# EAGLE design RSS 1.0 (EAGLE 6.5.0)
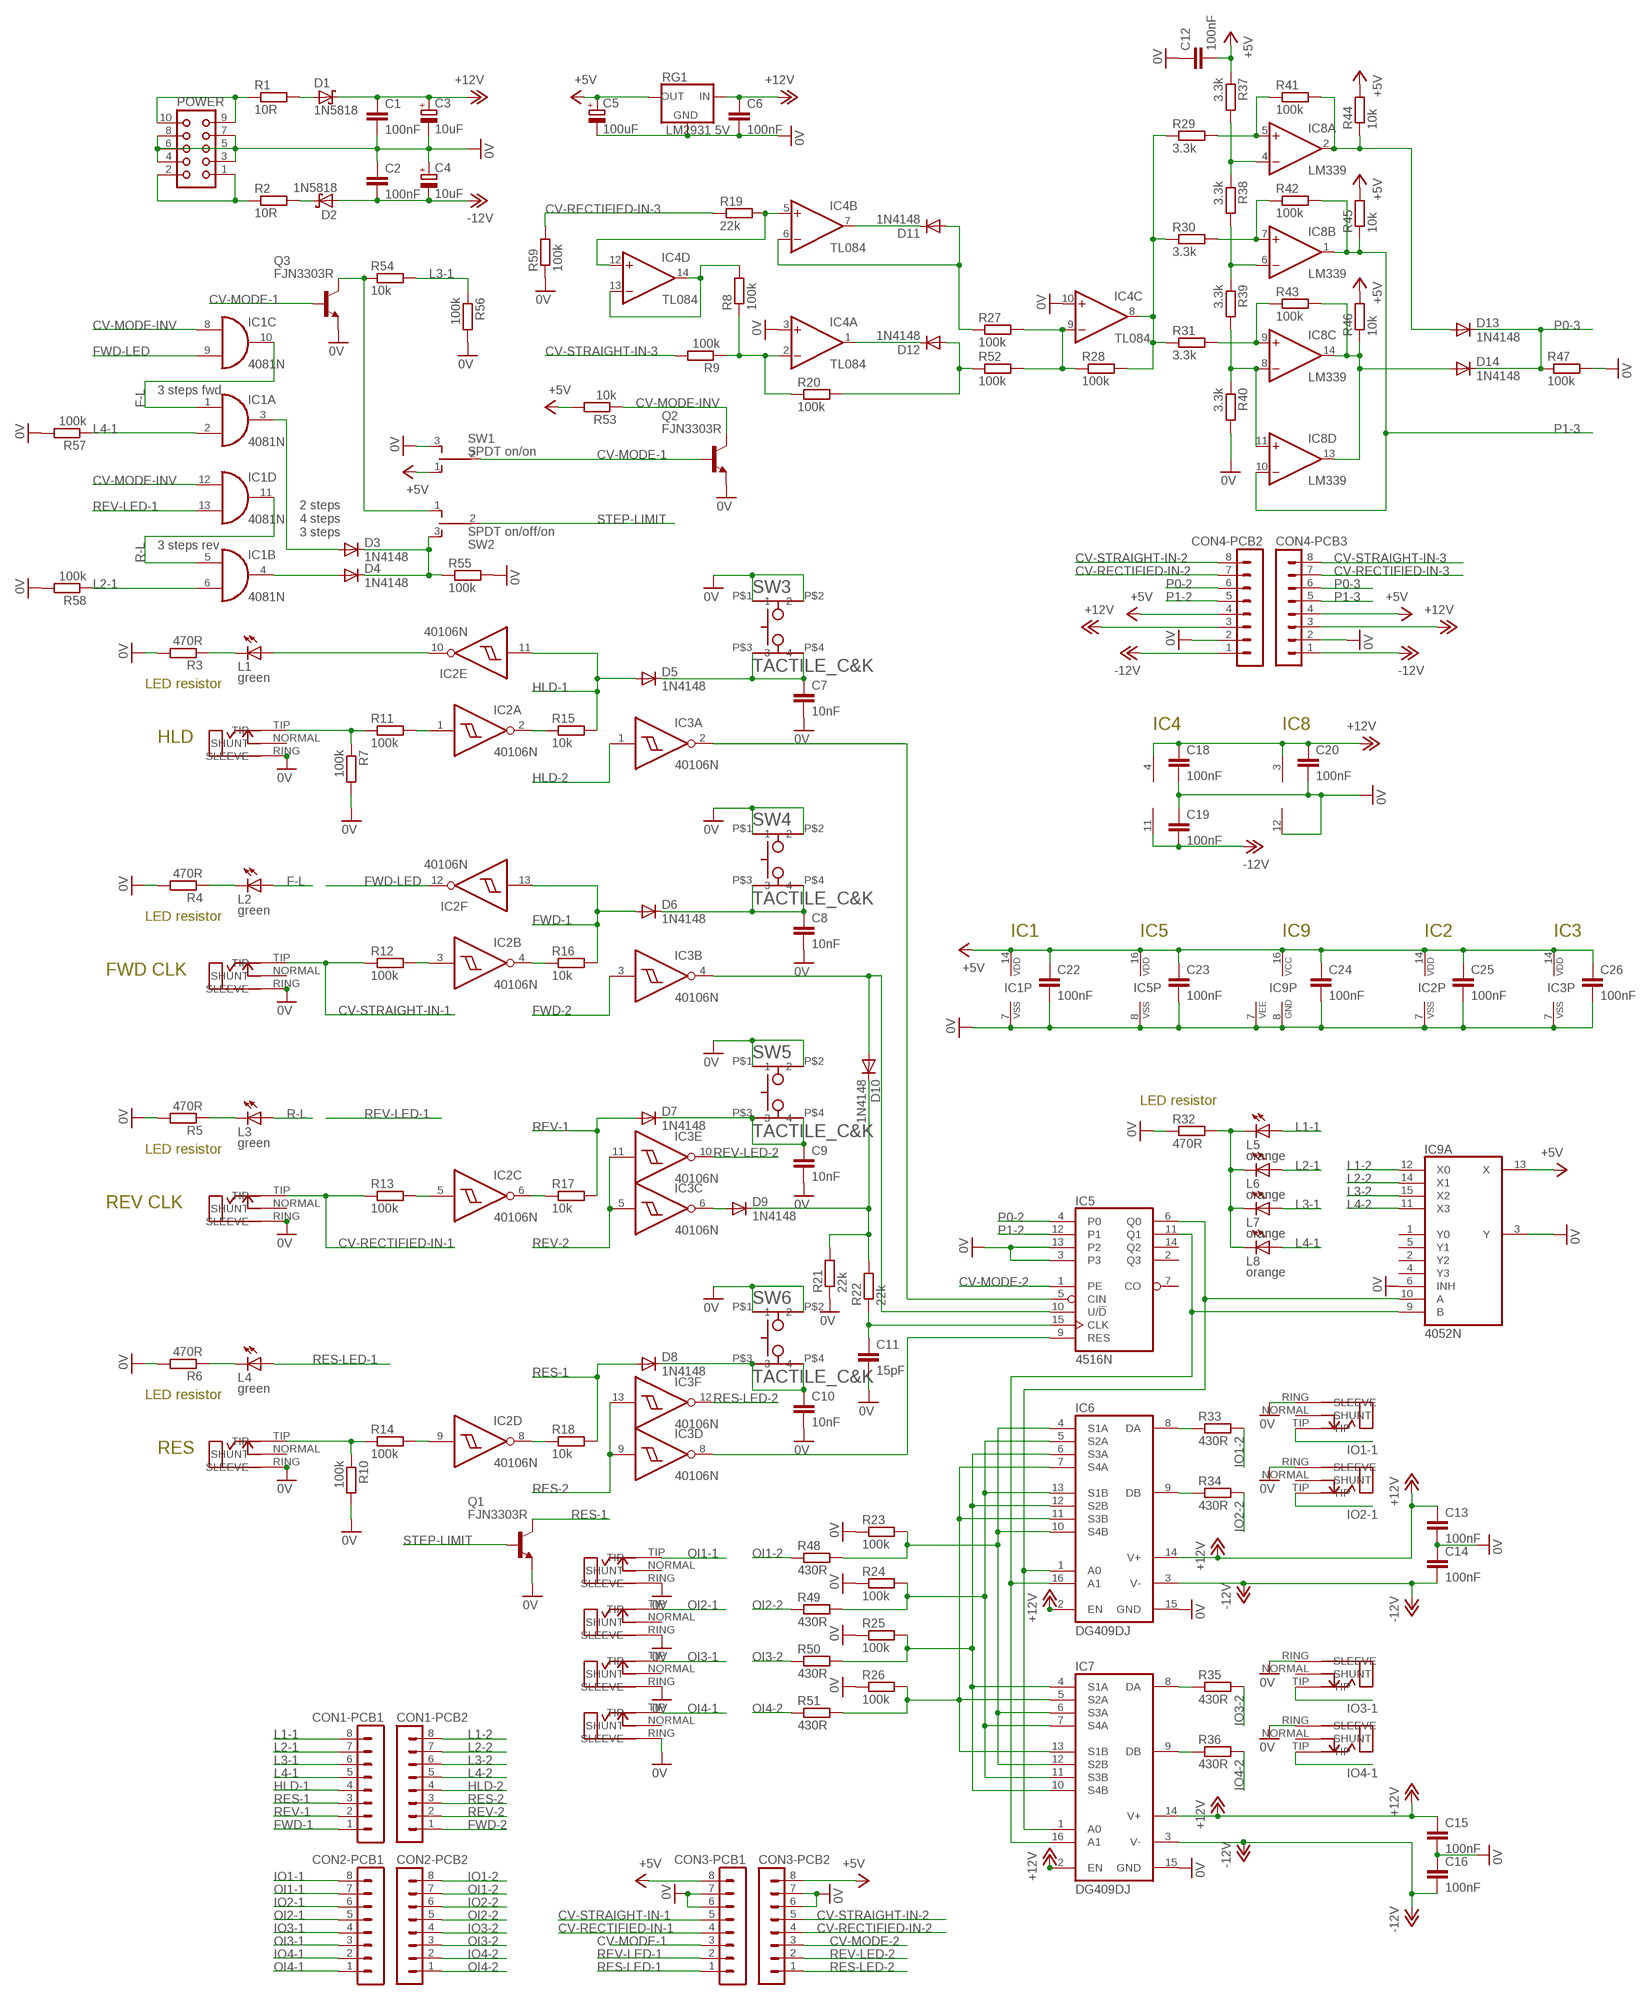
[diagram p0: schematic, sheet 1]

## Parts
C1  100nF  C-EU025-024X044  [C025-024X044]
C2  100nF  C-EU025-024X044  [C025-024X044]
C3  10uF  CPOL-EUE2-5  [E2-5]
C4  10uF  CPOL-EUE2-5  [E2-5]
C5  100uF  CPOL-EUE2.5-6  [E2,5-6]
C6  100nF  C-EU025-024X044  [C025-024X044]
C7  10nF  C-EU025-024X044  [C025-024X044]
C8  10nF  C-EU025-024X044  [C025-024X044]
C9  10nF  C-EU025-024X044  [C025-024X044]
C10  10nF  C-EU025-024X044  [C025-024X044]
C11  15pF  C-EU025-024X044  [C025-024X044]
C12  100nF  C-EU025-024X044  [C025-024X044]
C13  100nF  C-EU025-024X044  [C025-024X044]
C14  100nF  C-EU025-024X044  [C025-024X044]
C15  100nF  C-EU025-024X044  [C025-024X044]
C16  100nF  C-EU025-024X044  [C025-024X044]
C18  100nF  C-EU025-024X044  [C025-024X044]
C19  100nF  C-EU025-024X044  [C025-024X044]
C20  100nF  C-EU025-024X044  [C025-024X044]
C22  100nF  C-EU025-024X044  [C025-024X044]
C23  100nF  C-EU025-024X044  [C025-024X044]
C24  100nF  C-EU025-024X044  [C025-024X044]
C25  100nF  C-EU025-024X044  [C025-024X044]
C26  100nF  C-EU025-024X044  [C025-024X044]
CON1-PCB1  MA08-1  [MA08-1]
CON1-PCB2  MA08-1  [MA08-1]
CON2-PCB1  MA08-1  [MA08-1]
CON2-PCB2  MA08-1  [MA08-1]
CON3-PCB1  MA08-1  [MA08-1]
CON3-PCB2  MA08-1  [MA08-1]
CON4-PCB2  MA08-1  [MA08-1]
CON4-PCB3  MA08-1  [MA08-1]
D1  1N5818  SB130DO-204AL  [DO41-7]
D2  1N5818  SB130DO-204AL  [DO41-7]
D3  1N4148  1N4148DO35-6  [DO35-6]
D4  1N4148  1N4148DO35-6  [DO35-6]
D5  1N4148  1N4148DO35-6  [DO35-6]
D6  1N4148  1N4148DO35-6  [DO35-6]
D7  1N4148  1N4148DO35-6  [DO35-6]
D8  1N4148  1N4148DO35-6  [DO35-6]
D9  1N4148  1N4148DO35-6  [DO35-6]
D10  1N4148  1N4148DO35-6  [DO35-6]
D11  1N4148  1N4148DO35-6  [DO35-6]
D12  1N4148  1N4148DO35-6  [DO35-6]
D13  1N4148  1N4148DO35-6  [DO35-6]
D14  1N4148  1N4148DO35-6  [DO35-6]
FWD  ERTHENVAR_3.5MM_JACKINLINE2  [THONKICON-TWISTED]
HLD  ERTHENVAR_3.5MM_JACKINLINE2  [THONKICON-TWISTED]
I/O1  ERTHENVAR_3.5MM_JACKINLINE2  [THONKICON-TWISTED]
I/O2  ERTHENVAR_3.5MM_JACKINLINE2  [THONKICON-TWISTED]
I/O3  ERTHENVAR_3.5MM_JACKINLINE2  [THONKICON-TWISTED]
I/O4  ERTHENVAR_3.5MM_JACKINLINE2  [THONKICON-TWISTED]
IC1  4081N  [DIL14]
IC2  40106N  [DIL14]
IC3  40106N  [DIL14]
IC4  TL084  TL074P  [DIL14]
IC5  4516N  [DIL16]
IC6  DG409DJ  [DIL16]
IC7  DG409DJ  [DIL16]
IC8  LM339  LM2901N  [DIL14]
IC9  4052N  [DIL16]
L1  green  LED3MM  [LED3MM]
L2  green  LED3MM  [LED3MM]
L3  green  LED3MM  [LED3MM]
L4  green  LED3MM  [LED3MM]
L5  orange  LED3MM  [LED3MM]
L6  orange  LED3MM  [LED3MM]
L7  orange  LED3MM  [LED3MM]
L8  orange  LED3MM  [LED3MM]
O/I1  ERTHENVAR_3.5MM_JACKINLINE2  [THONKICON-TWISTED]
O/I2  ERTHENVAR_3.5MM_JACKINLINE2  [THONKICON-TWISTED]
O/I3  ERTHENVAR_3.5MM_JACKINLINE2  [THONKICON-TWISTED]
O/I4  ERTHENVAR_3.5MM_JACKINLINE2  [THONKICON-TWISTED]
POWER  CON10L  [CON10L]
Q1  FJN3303R  [TO92-LINE]
Q2  FJN3303R  [TO92-LINE]
Q3  FJN3303R  [TO92-LINE]
R1  10R  R-EU_0207/10  [0207/9]
R2  10R  R-EU_0207/10  [0207/9]
R3  470R  R-EU_0204/5  [0204/5]
R4  470R  R-EU_0204/5  [0204/5]
R5  470R  R-EU_0204/5  [0204/5]
R6  470R  R-EU_0204/5  [0204/5]
R7  100k  R-EU_0204/5  [0204/5]
R8  100k  R-EU_0204/5  [0204/5]
R9  100k  R-EU_0204/5  [0204/5]
R10  100k  R-EU_0204/5  [0204/5]
R11  100k  R-EU_0204/5  [0204/5]
R12  100k  R-EU_0204/5  [0204/5]
R13  100k  R-EU_0204/5  [0204/5]
R14  100k  R-EU_0204/5  [0204/5]
R15  10k  R-EU_0204/5  [0204/5]
R16  10k  R-EU_0204/5  [0204/5]
R17  10k  R-EU_0204/5  [0204/5]
R18  10k  R-EU_0204/5  [0204/5]
R19  22k  R-EU_0204/5  [0204/5]
R20  100k  R-EU_0204/5  [0204/5]
R21  22k  R-EU_0204/5  [0204/5]
R22  22k  R-EU_0204/5  [0204/5]
R23  100k  R-EU_0204/5  [0204/5]
R24  100k  R-EU_0204/5  [0204/5]
R25  100k  R-EU_0204/5  [0204/5]
R26  100k  R-EU_0204/5  [0204/5]
R27  100k  R-EU_0204/5  [0204/5]
R28  100k  R-EU_0204/5  [0204/5]
R29  3.3k  R-EU_0204/5  [0204/5]
R30  3.3k  R-EU_0204/5  [0204/5]
R31  3.3k  R-EU_0204/5  [0204/5]
R32  470R  R-EU_0204/5  [0204/5]
R33  430R  R-EU_0207/10  [0207/9]
R34  430R  R-EU_0207/10  [0207/9]
R35  430R  R-EU_0207/10  [0207/9]
R36  430R  R-EU_0207/10  [0207/9]
R37  3.3k  R-EU_0204/5  [0204/5]
R38  3.3k  R-EU_0204/5  [0204/5]
R39  3.3k  R-EU_0204/5  [0204/5]
R40  3.3k  R-EU_0204/5  [0204/5]
R41  100k  R-EU_0204/5  [0204/5]
R42  100k  R-EU_0204/5  [0204/5]
R43  100k  R-EU_0204/5  [0204/5]
R44  10k  R-EU_0204/5  [0204/5]
R45  10k  R-EU_0204/5  [0204/5]
R46  10k  R-EU_0204/5  [0204/5]
R47  100k  R-EU_0204/5  [0204/5]
R48  430R  R-EU_0207/10  [0207/9]
R49  430R  R-EU_0207/10  [0207/9]
R50  430R  R-EU_0207/10  [0207/9]
R51  430R  R-EU_0207/10  [0207/9]
R52  100k  R-EU_0204/5  [0204/5]
R53  10k  R-EU_0204/5  [0204/5]
R54  10k  R-EU_0204/5  [0204/5]
R55  100k  R-EU_0204/5  [0204/5]
R56  100k  R-EU_0204/5  [0204/5]
R57  100k  R-EU_0204/5  [0204/5]
R58  100k  R-EU_0204/5  [0204/5]
R59  100k  R-EU_0204/5  [0204/5]
RES  ERTHENVAR_3.5MM_JACKINLINE2  [THONKICON-TWISTED]
REV  ERTHENVAR_3.5MM_JACKINLINE2  [THONKICON-TWISTED]
RG1  LM2931 5V  78LXXLM2931XXX  [TO92-LINE]
SW1  SPDT on/on  SPDTTOP-SUBMINI  [SPDT-HORIZONTAL-TOP-SUBMINI-MULTICOMP]
SW2  SPDT on/off/on  SPDTTOP-SUBMINI  [SPDT-HORIZONTAL-TOP-SUBMINI-MULTICOMP]
SW3  TACTILE_C&K  [TACTILE_CK]
SW4  TACTILE_C&K  [TACTILE_CK]
SW5  TACTILE_C&K  [TACTILE_CK]
SW6  TACTILE_C&K  [TACTILE_CK]

## Nets
0V: C1.2 C2.1 C3.- C4.+ C5.- C6.2 C7.2 C8.2 C9.2 C10.2 C11.2 C12.1 C13.2 C14.1 C15.2 C16.1 C18.2 C19.1 C20.2 C22.2 C23.2 C24.2 C25.2 C26.2 CON3-PCB1.6 CON3-PCB1.7 CON3-PCB2.6 CON3-PCB2.7 CON4-PCB2.2 CON4-PCB3.2 FWD.RING(SLEEVE) HLD.RING(SLEEVE) I/O1.RING(SLEEVE) I/O2.RING(SLEEVE) I/O3.RING(SLEEVE) I/O4.RING(SLEEVE) IC1.7(P:VSS) IC2.7(P:VSS) IC3.7(P:VSS) IC4.3(A:+IN) IC4.10(C:+IN) IC5.3 IC5.8(VSS) IC5.13(P2) IC6.15(GND) IC7.15(GND) IC8.12(P:V-) IC9.3(A:Y) IC9.6(A:INH) IC9.7(P:VEE) IC9.8(P:GND) O/I1.RING(SLEEVE) O/I2.RING(SLEEVE) O/I3.RING(SLEEVE) O/I4.RING(SLEEVE) POWER.3 POWER.4 POWER.5 POWER.6 POWER.7 POWER.8 Q1.3(E) Q2.3(E) Q3.3(E) R3.2 R4.2 R5.2 R6.2 R7.2 R10.2 R21.1 R23.1 R24.1 R25.1 R26.1 R32.1 R40.2 R47.2 R55.2 R56.2 R57.2 R58.2 R59.1 RES.RING(SLEEVE) REV.RING(SLEEVE) RG1.2(GND) SW1.3 SW3.P$1 SW3.P$2 SW4.P$1 SW4.P$2 SW5.P$1 SW5.P$2 SW6.P$1 SW6.P$2
+5V: C5.+ C12.2 C22.1 C23.1 C24.1 C25.1 C26.1 CON3-PCB1.8 CON3-PCB2.8 CON4-PCB2.4 CON4-PCB3.4 IC1.14(P:VDD) IC2.14(P:VDD) IC3.14(P:VDD) IC5.16(VDD) IC9.13(A:X) IC9.16(P:VCC) R37.1 R44.2 R45.2 R46.2 R53.2 RG1.3(OUT) SW1.1
+12V: C1.1 C3.+ C6.1 C13.1 C15.1 C18.1 C20.1 CON4-PCB2.3 CON4-PCB3.3 D1.C IC4.4(P:V+) IC6.2(EN) IC6.14(V+) IC7.2(EN) IC7.14(V+) IC8.3(P:V+) RG1.1(IN)
-12V: C2.2 C4.- C14.2 C16.2 C19.2 CON4-PCB2.1 CON4-PCB3.1 D2.A IC4.11(P:V-) IC6.3(V-) IC7.3(V-)
BDF3R2T: C9.1 D7.CATHODE(C) SW5.P$3 SW5.P$4
CV-MODE-1: CON3-PCB1.3 Q2.1(B) Q3.1(B) SW1.2
CV-MODE-2: CON3-PCB2.3 IC5.1(PE)
CV-MODE-INV: IC1.8(C:I0) IC1.12(D:I0) Q2.2(C) R53.1
CV-RECTIFIED-IN-1: CON3-PCB1.4 R13.1 REV.TIP
CV-RECTIFIED-IN-2: CON3-PCB2.4 CON4-PCB2.7
CV-RECTIFIED-IN-3: CON4-PCB3.7 R19.1 R59.2
CV-STRAIGHT-IN-1: CON3-PCB1.5 FWD.TIP R12.1
CV-STRAIGHT-IN-2: CON3-PCB2.5 CON4-PCB2.8
CV-STRAIGHT-IN-3: CON4-PCB3.8 R9.2
DFGT43: C8.1 D6.CATHODE(C) SW4.P$3 SW4.P$4
DVW4D: D9.ANODE(A) IC3.6(C:O)
F-L: IC1.1(A:I0) IC1.10(C:O) L2.A
FGDFS33: IC3.2(A:O) IC5.5(CIN)
FSS44F: IC3.8(D:O) IC5.9(RES)
FWD-1: CON1-PCB1.1 D6.ANODE(A) IC2.13(F:I) R16.2
FWD-2: CON1-PCB2.1 IC3.3(B:I)
FWD-LED: IC1.9(C:I1) IC2.12(F:O)
HLD-1: CON1-PCB1.4 D5.ANODE(A) IC2.11(E:I) R15.2
HLD-2: CON1-PCB2.4 IC3.1(A:I)
IO1-1: CON2-PCB1.8 I/O1.TIP
IO1-2: CON2-PCB2.8 R33.2
IO2-1: CON2-PCB1.6 I/O2.TIP
IO2-2: CON2-PCB2.6 R34.2
IO3-1: CON2-PCB1.4 I/O3.TIP
IO3-2: CON2-PCB2.4 R35.2
IO4-1: CON2-PCB1.2 I/O4.TIP
IO4-2: CON2-PCB2.2 R36.2
L1-1: CON1-PCB1.8 L5.A
L1-2: CON1-PCB2.8 IC9.12(A:X0)
L2-1: CON1-PCB1.7 IC1.6(B:I1) L6.A R58.1
L2-2: CON1-PCB2.7 IC9.14(A:X1)
L3-1: CON1-PCB1.6 L7.A R54.2 R56.1
L3-2: CON1-PCB2.6 IC9.15(A:X2)
L4-1: CON1-PCB1.5 IC1.2(A:I1) L8.A R57.1
L4-2: CON1-PCB2.5 IC9.11(A:X3)
N$1: IC5.11(Q1) IC6.16(A1) IC7.16(A1) IC9.9(A:B)
N$2: IC5.6(Q0) IC6.1(A0) IC7.1(A0) IC9.10(A:A)
N$3: IC2.3(B:I) R12.2
N$4: C11.1 IC5.15(CLK) R22.1
N$5: IC6.9(DB) R34.1
N$6: IC7.9(DB) R36.1
N$7: L2.K(C) R4.1
N$8: HLD.TIP R7.1 R11.1
N$9: IC7.8(DA) R35.1
N$10: IC2.4(B:O) R16.1
N$11: IC2.6(C:O) R17.1
N$12: R10.1 R14.1 RES.TIP
N$13: IC6.8(DA) R33.1
N$14: L1.K(C) R3.1
N$15: L3.K(C) R5.1
N$16: IC2.8(D:O) R18.1
N$17: C10.1 D8.CATHODE(C) SW6.P$3 SW6.P$4
N$18: IC2.10(E:O) L1.A
N$19: D3.ANODE(A) IC1.3(A:O)
N$20: L4.K(C) R6.1
N$21: IC2.5(C:I) R13.2
N$22: POWER.1 POWER.2 R2.1
N$23: POWER.9 POWER.10 R1.1
N$24: D1.A R1.2
N$25: D2.C R2.2
N$26: IC2.9(D:I) R14.2
N$27: IC2.2(A:O) R15.1
N$28: C7.1 D5.CATHODE(C) SW3.P$3 SW3.P$4
N$29: IC4.2(A:-IN) R8.1 R9.1 R20.1
N$30: D4.ANODE(A) IC1.4(B:O)
N$32: IC8.4(A:-IN) R37.2 R38.1
N$33: IC8.6(B:-IN) R38.2 R39.1
N$34: IC8.8(C:-IN) IC8.11(D:+IN) R39.2 R40.1
N$35: D11.ANODE(A) IC4.6(B:-IN) R27.1
N$36: IC8.9(C:+IN) R31.2 R43.1
N$37: IC8.7(B:+IN) R30.2 R42.1
N$38: IC8.5(A:+IN) R29.2 R41.1
N$39: D9.CATHODE(C) D10.CATHODE(C) R21.2 R22.2
N$40: L5.K(C) L6.K(C) L7.K(C) L8.K(C) R32.2
N$41: D14.ANODE(A) IC8.13(D:OUT) IC8.14(C:OUT) R43.2 R46.1
N$42: IC6.6(S3A) IC6.12(S2B) IC7.4(S1A) IC7.10(S4B) R25.2 R50.2
N$43: D13.ANODE(A) IC8.2(A:OUT) R41.2 R44.1
N$45: IC4.5(B:+IN) IC4.12(D:+IN) R19.2
N$46: D11.CATHODE(C) IC4.7(B:OUT)
N$47: D3.CATHODE(C) D4.CATHODE(C) R55.1 SW2.3
N$48: IC6.7(S4A) IC6.11(S3B) IC7.5(S2A) IC7.13(S1B) R26.2 R51.2
N$51: IC2.1(A:I) R11.2
N$52: D12.CATHODE(C) IC4.1(A:OUT)
N$53: IC4.9(C:-IN) R27.2 R28.1 R52.2
N$54: IC4.8(C:OUT) R28.2 R29.1 R30.1 R31.1
N$56: IC6.5(S2A) IC6.13(S1B) IC7.7(S4A) IC7.11(S3B) R24.2 R49.2
N$57: IC6.4(S1A) IC6.10(S4B) IC7.6(S3A) IC7.12(S2B) R23.2 R48.2
N$58: IC4.13(D:-IN) IC4.14(D:OUT) R8.2
N$59: D12.ANODE(A) R20.2 R52.1
N$60: Q3.2(C) R54.1 SW2.1
OI1-1: CON2-PCB1.7 O/I1.TIP
OI1-2: CON2-PCB2.7 R48.1
OI2-1: CON2-PCB1.5 O/I2.TIP
OI2-2: CON2-PCB2.5 R49.1
OI3-1: CON2-PCB1.3 O/I3.TIP
OI3-2: CON2-PCB2.3 R50.1
OI4-1: CON2-PCB1.1 O/I4.TIP
OI4-2: CON2-PCB2.1 R51.1
P0-2: CON4-PCB2.6 IC5.4(P0)
P0-3: CON4-PCB3.6 D13.CATHODE(C) D14.CATHODE(C) R47.1
P1-2: CON4-PCB2.5 IC5.12(P1)
P1-3: CON4-PCB3.5 IC8.1(B:OUT) IC8.10(D:-IN) R42.2 R45.1
R-L: IC1.5(B:I0) IC1.11(D:O) L3.A
RES-1: CON1-PCB1.3 D8.ANODE(A) Q1.2(C) R18.2
RES-2: CON1-PCB2.3 IC3.9(D:I) IC3.13(F:I)
RES-LED-1: CON3-PCB1.1 L4.A
RES-LED-2: CON3-PCB2.1 IC3.12(F:O)
REV-1: CON1-PCB1.2 D7.ANODE(A) R17.2
REV-2: CON1-PCB2.2 IC3.5(C:I) IC3.11(E:I)
REV-LED-1: CON3-PCB1.2 IC1.13(D:I1)
REV-LED-2: CON3-PCB2.2 IC3.10(E:O)
STEP-LIMIT: Q1.1(B) SW2.2
XBGE4: D10.ANODE(A) IC3.4(B:O) IC5.10(U/!D)
Unconnected: FWD.NORMAL(SHUNT) HLD.NORMAL(SHUNT) I/O1.NORMAL(SHUNT) I/O2.NORMAL(SHUNT) I/O3.NORMAL(SHUNT) I/O4.NORMAL(SHUNT) IC5.2(Q3) IC5.7(CO) IC5.14(Q2) IC9.1(A:Y0) IC9.2(A:Y2) IC9.4(A:Y3) IC9.5(A:Y1) O/I1.NORMAL(SHUNT) O/I2.NORMAL(SHUNT) O/I3.NORMAL(SHUNT) O/I4.NORMAL(SHUNT) RES.NORMAL(SHUNT) REV.NORMAL(SHUNT)

## Notes on the sheet
- 3 steps fwd
- 2 steps
  4 steps
  3 steps
- 3 steps rev
- LED resistor
- IC4 | IC8
- HLD
- LED resistor
- IC1 | IC5 | IC9 | IC2 | IC3
- FWD CLK
- LED resistor
- LED resistor
- REV CLK
- LED resistor
- RES

## Library data of the parts
C1 C2 C6-C16 C18-C20 C22-C26 = Roll Your Own:C-EU: CAPACITOR, European symbol
C3-C5 = Roll Your Own:CPOL-EU: POLARIZED CAPACITOR, European symbol
CON1-PCB1 CON1-PCB2 CON2-PCB1 CON2-PCB2 CON3-PCB1 CON3-PCB2 CON4-PCB2 CON4-PCB3 = Roll Your Own:MA08-1: PIN HEADER; OC_FARNELL: unknown; OC_NEWARK: unknown
D1 D2 = Roll Your Own:SB130
D3-D14 = Roll Your Own:1N4148: DIODE high speed (Philips)
FWD HLD I/O1-I/O4 O/I1-O/I4 RES REV = Roll Your Own:ERTHENVAR_3.5MM_JACK
IC1 = Roll Your Own:4081: Quad 2-input AND
IC2 IC3 = Roll Your Own:40106: Hex SCHMITT TRIGGER
IC4 = Roll Your Own:TL074: OP AMP
IC5 = Roll Your Own:4516: Binary up down COUNTER
IC6 IC7 = maxim:DG409DJ: ANALOG MULTIPLEXER; MF: INTERSIL; MPN: DG409DJ; OC_FARNELL: 9664084; OC_NEWARK: 06F3963
IC8 = Roll Your Own:LM2901: COMPARATOR
IC9 = Roll Your Own:4052: Dual 4-channel ANALOG MULTIPLEXER
L1-L8 = Roll Your Own:LED: LED OSRAM: - CHIPLED LG R971, LG N971, LY N971, LG Q971, LY Q971, LO R971, LY R971 LH N974, LH R974 LS Q976, LO Q976, LY Q976 LO Q996 - Hyper CHIPLED LW Q18S LB Q993, LB Q99A, LB R99A - SideLED LS A670, LO A670, LY A670, LG A670, LP A670 LB A673, LV A673, LT A673, LW A673 LH A674 LY A675 LS A676, LA A676, LO A676, LY A676, LW A676 LS A679, LY A679, LG A679 - Hyper Micro SIDELED® LS Y876, LA Y876, LO Y876, LY Y876 LT Y87S - SmartLED LW L88C, LW L88S LB L89C, LB L89S, LG L890 LS L89K, LO L89K, LY L89K LS L896, LA L896, LO L896, LY L896 - TOPLED LS T670, LO T670, LY T670, LG T670, LP T670 LSG T670, LSP T670, LSY T670, LOP T670, LYG T670 LG T671, LOG T671, LSG T671 LB T673, LV T673, LT T673, LW T673 LH T674 LS T676, LA T676, LO T676, LY T676, LB T676, LH T676, LSB T676, LW T676 LB T67C, LV T67C, LT T67C, LS T67K, LO T67K, LY T67K, LW E67C LS E67B, LA E67B, LO E67B, LY E67B, LB E67C, LV E67C, LT E67C LW T67C LS T679, LY T679, LG T679 LS T770, LO T770, LY T770, LG T770, LP T770 LB T773, LV T773, LT T773, LW T773 LH T774 LS E675, LA E675, LY E675, LS T675 LS T776, LA T776, LO T776, LY T776, LB T776 LHGB T686 LT T68C, LB T68C - Hyper Mini TOPLED® LB M676 - Mini TOPLED Santana® LG M470 LS M47K, LO M47K, LY M47K Source: http://www.osram.convergy.de LUXEON: - LUMILED® LXK2-PW12-R00, LXK2-PW12-S00, LXK2-PW14-U00, LXK2-PW14-V00 LXK2-PM12-R00, LXK2-PM12-S00, LXK2-PM14-U00 LXK2-PE12-Q00, LXK2-PE12-R00, LXK2-PE12-S00, LXK2-PE14-T00, LXK2-PE14-U00 LXK2-PB12-K00, LXK2-PB12-L00, LXK2-PB12-M00, LXK2-PB14-N00, LXK2-PB14-P00, LXK2-PB14-Q00 LXK2-PR12-L00, LXK2-PR12-M00, LXK2-PR14-Q00, LXK2-PR14-R00 LXK2-PD12-Q00, LXK2-PD12-R00, LXK2-PD12-S00 LXK2-PH12-R00, LXK2-PH12-S00 LXK2-PL12-P00, LXK2-PL12-Q00, LXK2-PL12-R00 Source: www.luxeon.com KINGBRIGHT: KA-3528ASYC Source: www.kingbright.com
POWER = Roll Your Own:CON10L: CONNECTOR; OC_FARNELL: unknown; OC_NEWARK: unknown
Q1-Q3 = Roll Your Own:FJN3303R
R1-R59 = Roll Your Own:R-EU_: RESISTOR, European symbol
RG1 = Roll Your Own:78LXX: VOLTAGE REGULATOR
SW1 SW2 = Roll Your Own:SPDT: Horizontal SPDT switch in the center-off position.
SW3-SW6 = Roll Your Own:TACTILE_C&K

## Board
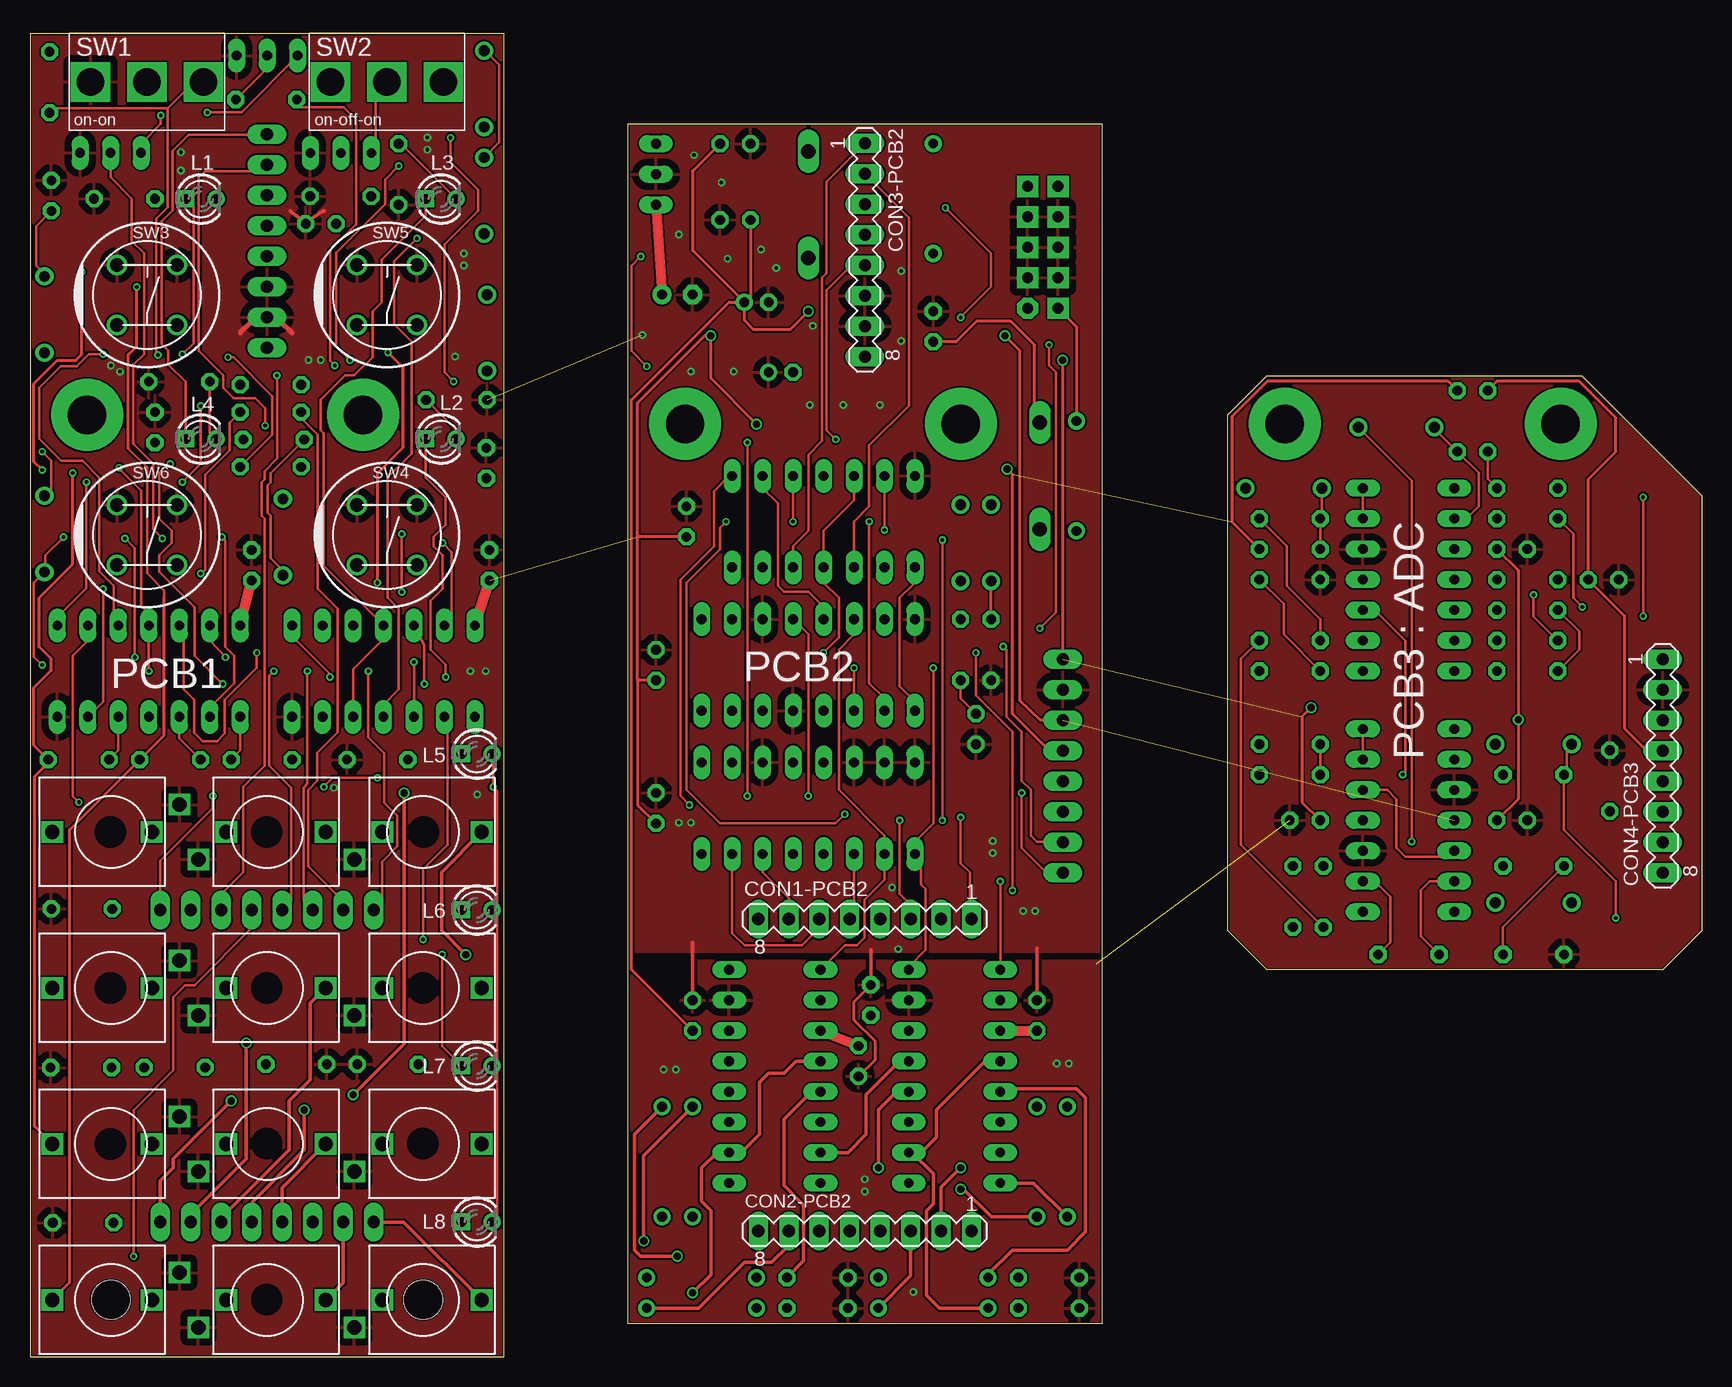
[diagram p1: board, top side]
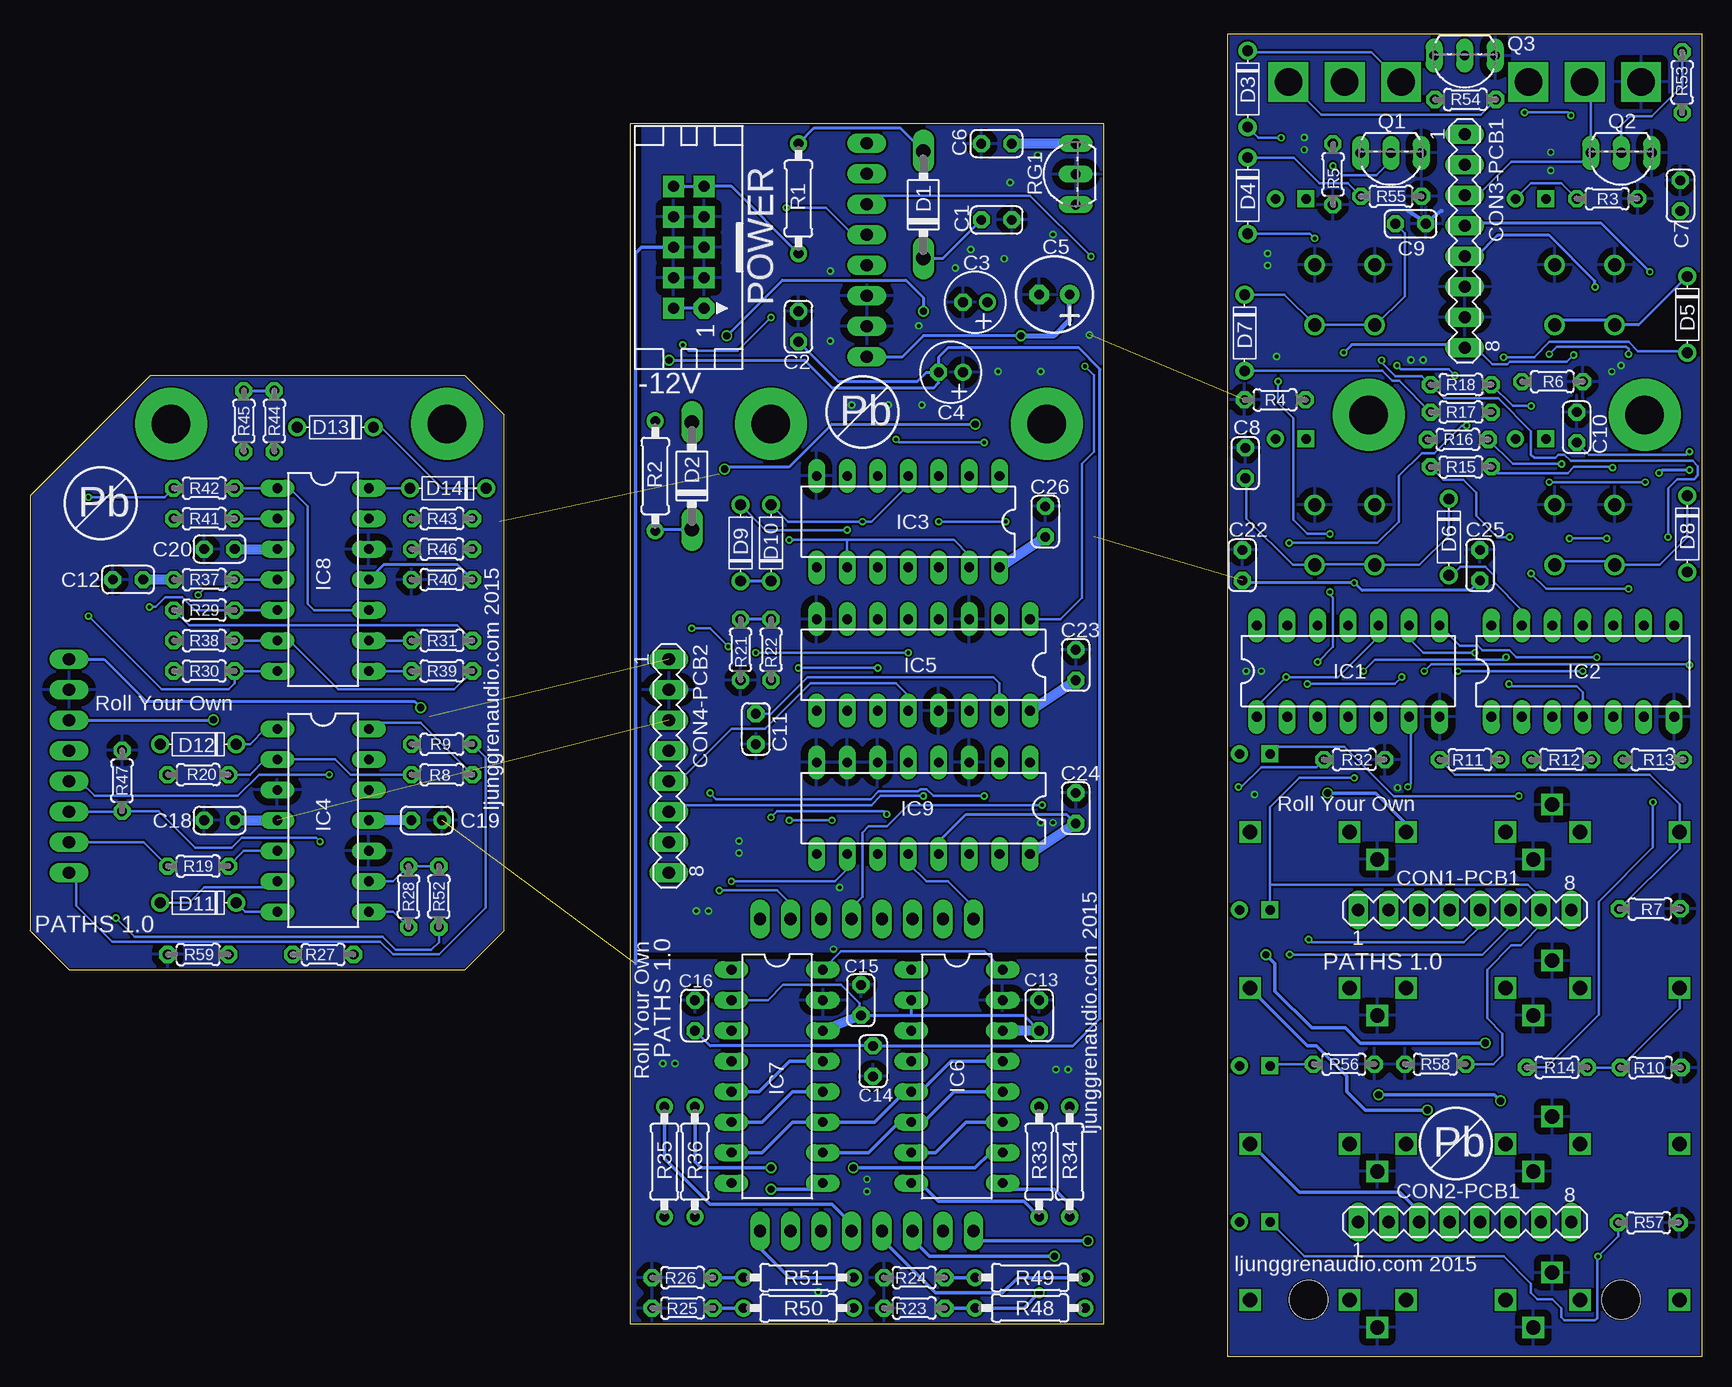
[diagram p2: board, bottom side, seen from below]

Size 139.35 x 110.25 mm. Coordinates in mm from the lower left corner, seen from the top.
Outline: 0,0 39.5,0 39.5,110.25 0,110.25 0,0
Outline: 89.35,102.75 89.35,2.75 49.85,2.75 49.85,102.75 89.35,102.75
Outline: 103.1,81.75 129.35,81.75 139.35,71.75 139.35,35.5 136.1,32.25 103.1,32.25 99.85,35.5 99.85,78.5 103.1,81.75
Copper layers (1*16): Top 0.035mm / dielectric 1.5mm / Bottom 0.035mm
Design rules "hackvana 15 mil pads 24 mil thermal *": minimum track width 6mil, minimum drill 0.3mm, track to track 6mil, track to pad 6mil, pad to pad 6mil, via to via 6mil, smd to smd 0mil, copper to edge 6mil, drill to drill 6mil, minimum pad ring 12mil, minimum via ring 6mil, stop-mask expansion 2mil, vias tented up to drill 100mil, thermal gap 24mil
Holes 3.2 mm at 6.73,4.76 32.77,4.76
tRestrict: area 54,28.5 to 56.4,30.9; area 68.9,29.8 to 71.3,32.2; area 67.9,22.2 to 70.3,24.6; area 82.7,28.5 to 85.1,30.9; area 18.5,16.6 to 20.9,19; area 5.5,16.5 to 7.9,18.9; area 31.5,16.6 to 33.9,19; area 18.5,3.6 to 20.9,6; area 5.5,29.5 to 7.9,31.9; area 18.5,29.5 to 20.9,31.9; area 31.5,29.5 to 33.9,31.9; area 31.6,42.6 to 34,45; 2 more areas; 9 lines
bRestrict: area 54,28.5 to 56.4,30.9; area 68.9,29.8 to 71.3,32.2; area 67.9,22.2 to 70.3,24.6; area 82.7,28.5 to 85.1,30.9; 1 lines

### Footprints (pad centres in the part's own frame; a part is rotated, then mirrored left to right if it is on the bottom)
C025-024X044 = drill 0.813 octagon: 1 -1.27,0; 2 1.27,0
E2-5 = drill 0.813 pad 1.27: + -1.016,0 | drill 0.813 pad 1.27 octagon: - 1.016,0
E2,5-6 = drill 0.813 pad 1.6: + -1.27,0 | drill 0.813 pad 1.6 octagon: - 1.27,0
MA08-1 = drill 1.016 long: 1 -8.89,0; 2 -6.35,0; 3 -3.81,0; 4 -1.27,0; 5 1.27,0; 6 3.81,0; 7 6.35,0; 8 8.89,0
DO41-7 = drill 1.2 pad 1.6 long: A 4.445,0; C -4.445,0
DO35-6 = drill 0.9: ANODE 3.175,0; CATHODE -3.175,0
THONKICON-TWISTED = drill 1.2 square: NORMAL 0,-3.4; RING 2.286,-5.715; TIP 0,4.9
DIL14 = drill 0.813 long: 1 -7.62,-3.81; 2 -5.08,-3.81; 3 -2.54,-3.81; 4 0,-3.81; 5 2.54,-3.81; 6 5.08,-3.81; 7 7.62,-3.81; 8 7.62,3.81; 9 5.08,3.81; 10 2.54,3.81; 11 0,3.81; 12 -2.54,3.81; 13 -5.08,3.81; 14 -7.62,3.81
DIL16 = drill 0.813 long: 1 -8.89,-3.81; 2 -6.35,-3.81; 3 -3.81,-3.81; 4 -1.27,-3.81; 5 1.27,-3.81; 6 3.81,-3.81; 7 6.35,-3.81; 8 8.89,-3.81; 9 8.89,3.81; 10 6.35,3.81; 11 3.81,3.81; 12 1.27,3.81; 13 -1.27,3.81; 14 -3.81,3.81; 15 -6.35,3.81; 16 -8.89,3.81
LED3MM = drill 0.813 square: A -1.27,0 | drill 0.813: K 1.27,0
CON10L = drill 0.914 pad 1.778 octagon: 1 5.08,1.27 | drill 0.914 pad 1.778 square: 2 5.08,-1.27; 3 2.54,1.27; 4 2.54,-1.27; 5 0,1.27; 6 0,-1.27; 7 -2.54,1.27; 8 -2.54,-1.27; 9 -5.08,1.27; 10 -5.08,-1.27
TO92-LINE = drill 0.813 long: 1 2.54,0; 2 0,0; 3 -2.54,0
0207/9 = drill 0.813: 1 -4.58,0; 2 4.58,0
0204/5 = drill 0.813 octagon: 1 -2.54,0; 2 2.54,0
SPDT-HORIZONTAL-TOP-SUBMINI-MULTICOMP = drill 2.3 pad 3.1 square: 1 4.7,0; 2 0,0; 3 -4.7,0
TACTILE_CK = drill 1.1: P$1 -2.5,2.5; P$2 2.5,2.5; P$3 -2.5,-2.5; P$4 2.5,-2.5

### Placement (x,y rotation side)
C1  58.78,94.75 0 bottom
C2  75.29,85.86 270 bottom
C3  60.56,87.9 180 bottom
C4  62.59,82.05 180 bottom
C5  53.96,88.53 180 bottom
C6  58.78,101.1 180 bottom
C7  1.78,96.77 90 bottom
C8  38.04,74.49 90 bottom
C9  24.26,94.42 0 bottom
C10  10.42,77.47 90 bottom
C11  78.85,52.34 270 bottom
C12  131.17,64.78 0 bottom
C13  55.23,28.46 90 bottom
C14  69.07,24.65 90 bottom
C15  70.08,29.73 90 bottom
C16  83.93,28.46 270 bottom
C18  123.55,44.72 180 bottom
C19  106.28,44.72 180 bottom
C20  123.55,67.32 180 bottom
C22  38.29,65.98 90 bottom
C23  52.18,57.67 90 bottom
C24  52.18,45.73 90 bottom
C25  18.48,65.98 90 bottom
C26  54.72,69.61 90 bottom
CON1-PCB1  19.75,37.24 0 bottom
CON1-PCB2  69.6,36.49 180 top
CON2-PCB1  19.75,11.24 0 bottom
CON2-PCB2  69.6,10.49 180 top
CON3-PCB1  19.75,93 270 bottom
CON3-PCB2  69.6,92.25 270 top
CON4-PCB2  86.1,49.25 270 bottom
CON4-PCB3  136.1,49.25 270 top
D1  64.88,96.02 90 bottom
D2  84.18,73.42 90 bottom
D3  37.85,105.66 270 bottom
D4  37.85,96.77 270 bottom
D5  1.21,86.87 270 bottom
D6  21.09,68.33 270 bottom
D7  38.1,85.34 270 bottom
D8  1.21,68.58 270 bottom
D9  80.12,67.83 90 bottom
D10  77.58,67.83 90 bottom
D11  125.33,37.86 180 bottom
D12  125.33,51.07 180 bottom
D13  113.9,77.48 180 bottom
D14  104.5,72.4 180 bottom
FWD  6.75,4.75 90 top
HLD  6.75,43.75 90 top
I/O1  19.75,43.75 270 top
I/O2  19.75,30.75 270 top
I/O3  19.75,17.75 270 top
I/O4  19.75,4.75 270 top
IC1  29.47,57.15 0 bottom
IC2  9.91,57.15 0 bottom
IC3  66.15,69.61 180 bottom
IC4  114.92,44.72 270 bottom
IC5  64.88,57.67 180 bottom
IC6  62.08,23.38 270 bottom
IC7  77.07,23.38 270 bottom
IC8  114.92,64.78 270 bottom
IC9  64.88,45.73 180 bottom
L1  14.25,96.5 0 top
L2  34.25,76.5 0 top
L3  34.25,96.5 0 top
L4  14.25,76.5 0 top
L5  37.25,50.25 0 top
L6  37.25,37.25 0 top
L7  37.25,24.25 0 top
L8  37.25,11.25 0 top
O/I1  32.75,43.75 270 top
O/I2  32.75,30.75 270 top
O/I3  32.75,17.75 270 top
O/I4  32.75,4.75 270 top
POWER  84.44,92.47 270 bottom
Q1  25.91,100.33 180 bottom
Q2  6.71,100.34 180 bottom
Q3  19.76,108.45 180 bottom
R1  75.29,96.53 90 bottom
R2  87.23,73.42 270 bottom
R3  7.88,96.52 0 bottom
R4  35.56,79.76 180 bottom
R5  30.74,98.55 270 bottom
R6  12.45,81.28 0 bottom
R7  4.32,37.34 0 bottom
R8  105.01,48.53 0 bottom
R9  105.01,51.07 0 bottom
R10  4.26,24.12 0 bottom
R11  19.31,49.78 0 bottom
R12  11.69,49.78 180 bottom
R13  4.07,49.78 180 bottom
R14  12.06,24.13 180 bottom
R15  20.07,74.17 0 bottom
R16  20.32,76.45 180 bottom
R17  20.07,78.74 180 bottom
R18  20.07,81.03 180 bottom
R19  125.33,40.91 0 bottom
R20  125.33,48.53 180 bottom
R21  80.12,58.94 90 bottom
R22  77.58,58.94 90 bottom
R23  65.64,4.08 0 bottom
R24  65.64,6.62 0 bottom
R25  84.94,4.08 0 bottom
R26  84.94,6.62 0 bottom
R27  114.92,33.54 0 bottom
R28  107.8,38.37 270 bottom
R29  124.82,62.24 0 bottom
R30  124.82,57.16 0 bottom
R31  105.01,59.7 180 bottom
R32  28.96,49.78 180 bottom
R33  55.23,16.27 90 bottom
R34  52.69,16.27 90 bottom
R35  86.47,16.27 90 bottom
R36  83.93,16.27 90 bottom
R37  124.82,64.78 0 bottom
R38  124.82,59.7 0 bottom
R39  105.01,57.16 180 bottom
R40  105.01,64.78 180 bottom
R41  124.82,69.86 0 bottom
R42  124.82,72.4 0 bottom
R43  105.01,69.86 180 bottom
R44  118.98,77.99 90 bottom
R45  121.52,77.99 90 bottom
R46  105.01,67.32 0 bottom
R47  131.68,48.02 90 bottom
R48  55.99,4.08 180 bottom
R49  55.99,6.62 180 bottom
R50  75.29,4.08 180 bottom
R51  75.29,6.62 180 bottom
R52  105.26,38.37 90 bottom
R53  1.63,106.22 270 bottom
R54  19.7,104.79 180 bottom
R55  25.89,96.72 0 bottom
R56  29.83,24.4 0 bottom
R57  4.43,11.19 0 bottom
R58  22.21,24.4 180 bottom
R59  125.33,33.54 0 bottom
RES  6.75,30.75 90 top
REV  6.75,17.75 90 top
RG1  52.18,98.56 90 bottom
SW1  9.75,106.25 0 top
SW2  29.75,106.25 0 top
SW3  9.75,88.5 0 top
SW4  29.75,68.5 0 top
SW5  29.75,88.5 0 top
SW6  9.75,68.5 0 top

### Tracks (layer width: path | path; a pad name or v marks a point on that pad's centre or on a via)
0V  (via drill 0.3)  (2 unrouted)
  Top 0.254: C14.1 70.47,24.78 70.47,26.3 68.69,28.08 68.69,29.6 C15.2
  Top 0.305: C13.2 55.23,34.56 | C16.1 83.93,34.05 | C15.2 70.08,33.92
  Top 0.35: 24.49,95.52 22.97,94.5 21.7,95.52
  Top 0.406: 20.83,86.36 21.85,85.34 | 18.55,86.36 17.53,85.34
  Bottom 0.305: 88.88,32.78 88.88,91.96 88.37,92.47 POWER.6
  Bottom 0.35: 24.49,95.52 22.97,94.5 21.7,95.52
  other vias: 6.73,82.61 37.98,57.15 73.64,5.41 69.58,13.79 69.58,14.81 86.59,24.46 85.58,24.46 53.83,23.95 52.81,23.95 65,79.32 58.66,82.12 62.21,90.75 60.94,92.28 54.08,93.55 51.04,85.17 57.64,97.87 67.8,79.32 70.85,79.32 55.1,82.12 58.15,91.52 55.35,100.15 72.62,84.66 72.62,90.5 65.26,85.93 55.1,44.53 54.08,44.53 83.8,37.16 82.78,37.16 80.24,43 80.24,41.99 71.86,39.13 72.37,33.98 12.58,98.87 23.22,83.07 24.24,83.07 35.44,83.38 25.34,47.43 36.71,57.15 37.28,46.86 7.5,82.11 12.58,100.39 33.13,101.61 33.13,100.6 36.18,91.96 36.18,90.94
  pour Top: -0.25,111.25 39.63,111.25 39.63,-0.25 -0.25,-0.25
  pour Bottom: -0.25,111.51 39.88,111.51 39.88,-0.25 -0.25,-0.25
  pour Top: 49.13,33.03 89.77,33.03 89.77,2.55 49.13,2.55
  pour Bottom: 49.64,33.03 89.77,33.03 89.77,2.3 49.64,2.3
  pour Top: 49.64,33.79 89.77,33.79 89.77,102.88 49.64,102.88
  pour Bottom: 49.64,33.79 88.25,33.79 88.25,102.88 49.64,102.88
  pour Top: 99.42,82.31 140.06,82.31 140.06,31.76 99.42,31.76
  pour Bottom: 99.42,82.31 139.81,82.31 139.81,31.76 99.42,31.76
+5V  (via drill 0.3, 0.6)  (2 unrouted)
  Top 0.22: v10.67,83.5 10.52,83.65 10.52,94.85 11.5,95.82 11.5,104.05 | 11.5,104.05 11.54,104.09 13.7,106.25 SW1.1 | R53.2 2,104.05 11.5,104.05
  Top 0.254: v28.96,64.52 28.96,73.66 31.12,75.82 31.12,82.42 v29.85,83.69 | C23.1 50.65,56.4 | 50.65,56.4 50.65,45.99 C24.1 | 50.65,56.4 50.65,68.34 | 50.65,68.34 50.65,79.51 56.24,85.1 v56.75,85.1 56.75,81.55 v60.56,77.74 | C26.1 50.65,68.34 | CON4-PCB2.4 86.06,50.56 84.94,50.56 81.9,53.61 81.9,73.55 v81.45,73.99 | CON4-PCB3.4 134.77,50.52 132.95,52.34 132.95,61.73 C12.2 129.9,73.15 132.19,75.44 132.19,78.25 129.15,81.29 122.28,81.29 R45.2 | R44.2 118.22,81.29 103.14,81.29 100.18,78.33 100.18,69.61 R46.2
  Top 0.813: IC2.14 C25.1 | IC1.14 C22.1 | RG1.3 C5.+
  Bottom 0.22: CON3-PCB1.8 19.71,84.07 18.8,84.07 17.47,82.74 16.2,82.74 16.01,82.93 11.24,82.93 v10.67,83.5
  Bottom 0.254: C25.1 19.31,63.88 28.33,63.88 v28.96,64.52 38.1,64.52 C22.1 | CON3-PCB1.8 21.12,84.36 29.18,84.36 v29.85,83.69 | IC9.13 63.61,42.94 61.32,45.22 52.94,45.22 C24.1 | v56.75,85.1 64.88,85.1 66.66,83.32 69.56,83.32 CON3-PCB2.8 | v81.45,73.99 81.26,74.18 76.05,74.18 72.5,77.74 v60.56,77.74 | R45.2 R44.2
  Bottom 0.406: v56.75,85.1 53.96,85.1 52.69,86.37 C5.+
  Bottom 0.813: C24.1 IC9.16 | C23.1 IC5.16 | C26.1 IC3.14 | R37.1 C12.2
+12V  (via drill 0.6)  (1 unrouted)
  Top 0.254: C13.1 50.15,32.27 50.15,79.77 58.27,87.9 C3.+ | C6.1 55.23,98.82 55.23,92.21 C3.+ | C1.1 60.05,88.4 C3.+ | CON4-PCB2.3 84.22,53.06 82.53,54.69 82.53,83.83 v81.26,85.1 | v64.88,87.13 63.35,85.61 60.31,85.61 59.54,86.37 C3.+ | C20.1 124.06,65.54 v124.06,53.1 124.06,46.49 C18.1
  Bottom 0.22: IC7.2 77.83,29.73 76.56,31 71.74,31 70.21,29.48 70.21,28.59 C15.1
  Bottom 0.254: C15.1 65.89,28.46 | 65.89,28.46 56.5,28.46 C13.1 | D1.C 63.23,91.58 C1.1 | v81.26,85.1 76.62,89.74 66.34,89.74 64.88,88.28 v64.88,87.13 | CON4-PCB3.3 124.1,53.06 v124.06,53.1 | IC6.2 65.89,28.46
  Bottom 0.813: C13.1 IC6.14 | C15.1 IC7.14 | RG1.1 C6.1 | C18.1 IC4.4 | C20.1 IC8.3
-12V  (via drill 0.6)  (1 unrouted)
  Top 0.254: CON4-PCB2.1 86.09,58.66 v86.09,83.07 | D2.A 83.74,78.31 83.74,84.34 81.77,86.31 78.91,86.31 77.2,84.59 C2.2 | v106.79,54.11 106.03,53.35 106.03,46.24 C19.2
  Top 0.813: IC6.3 C14.2 | IC7.3 C16.2
  Bottom 0.254: C4.- 63.61,83.32 62.85,84.09 51.92,84.09 50.15,82.31 50.15,28.21 52.43,25.92 C14.2 82.66,25.92 C16.2 | C2.2 71.99,81.29 65.39,81.29 64.62,82.05 C4.- | v86.09,83.07 74.78,83.07 72.5,80.78 63.99,80.78 63.61,81.17 C4.- | CON4-PCB3.1 133.17,58.14 129.65,54.62 107.3,54.62 v106.79,54.11
  Bottom 0.813: C19.2 IC4.11
BDF3R2T
  Bottom 0.22: D7.CATHODE 34.77,88.52 SW5.P$4 SW5.P$3 27.15,86 24.75,88.4 24.75,93.64 C9.1
CV-MODE-1  (via drill 0.3)
  Top 0.22: Q3.1 17.63,103.71 v14.78,103.71 | v10.9,103.45 10.9,102.75 9.25,101.1 Q2.1
  Bottom 0.22: CON3-PCB1.3 19.71,96.77 19.45,97.04 18.4,97.04 15.86,99.58 9.76,99.58 9.25,100.09 Q2.1 9.25,105.75 SW1.2 | v14.78,103.71 11.16,103.71 v10.9,103.45
CV-MODE-2  (via drill 0.3)
  Top 0.22: v50.91,91.71 50.15,90.94 50.15,83.83 v51.42,82.56
  Bottom 0.22: CON3-PCB2.3 68.87,96.79 55.99,96.79 v50.91,91.71 | v51.42,82.56 50.65,81.8 50.65,75.45 51.67,74.43 51.67,63.26 53.45,61.48 IC5.1
CV-MODE-INV  (via drill 0.3)
  Top 0.22: IC1.12 32.87,59.33 v32.87,56.08 | v25,56.65 25,56.91 21.85,60.06 IC1.8 | Q2.2 6.71,98.31 8.49,96.53 8.49,92.98 9.51,91.96 9.51,83.58 8.62,82.69 8.62,76.08 10.27,74.43 10.27,68.97 v11.03,68.21 | v7.92,68.21 8.74,67.39 v8.74,58.3
  Bottom 0.22: v32.87,56.08 25.57,56.08 v25,56.65 | R53.1 1.63,105.93 4.17,103.39 5.95,103.39 6.71,102.63 Q2.2 | IC1.8 20.15,59.26 18.65,59.26 18.27,58.88 16.05,58.88 15.47,58.3 v8.74,58.3 | v7.92,68.21 v11.03,68.21
CV-RECTIFIED-IN-1  (via drill 0.3)
  Top 0.22: REV.TIP 1.78,17.82 | 1.53,49.53 R13.1
  Top 0.254: 1.53,49.53 0.39,48.39 0.39,19.21 REV.TIP | R13.1 0.32,50.99 0.32,55.75 1.78,57.21 1.78,58.17 0.77,59.18 0.77,63.25 3.56,66.04 v3.56,73.66 | v1.02,73.91 0.32,74.61 0.32,81.09 2.29,83.06 3.81,83.06 4.32,83.57 v4.32,90.42
  Bottom 0.22: 18.55,94.49 18.76,94.27 CON3-PCB1.4
  Bottom 0.254: v3.56,73.66 3.31,73.91 v1.02,73.91 | v4.32,90.42 8.39,94.49 18.55,94.49
CV-RECTIFIED-IN-2  (via drill 0.3)
  Top 0.22: v77.58,86.63 80.12,89.17 80.12,91.96 v76.31,95.77 | v84.94,84.34 84.94,82.63 85.52,82.05 85.52,62.05 v84.18,60.72 | v81.13,59.19 81.39,58.94 81.39,53.35 82.66,52.08 82.66,48.02 83.42,47.26 83.42,43.45 83.93,42.94 86.06,42.94 CON4-PCB2.7
  Bottom 0.22: 69.64,93.48 CON3-PCB2.4 69.82,93.74 70.97,93.74 73.01,95.77 v76.31,95.77 | v77.58,86.63 80.37,83.83 84.44,83.83 v84.94,84.34 | v84.18,60.72 82.66,60.72 v81.13,59.19
CV-RECTIFIED-IN-3
  Top 0.22: R59.2 122.79,35.83 R19.1
  Bottom 0.22: CON4-PCB3.7 129.86,42.9 R19.1
CV-STRAIGHT-IN-1  (via drill 0.3)
  Top 0.22: FWD.TIP 1.78,4.82 | 8.2,75.69 9.76,74.13 9.76,65.29 11.18,63.87 11.18,63.31
  Top 0.254: 11.18,63.31 11.18,51.82 R12.1 3.31,43.94 3.31,6.21 FWD.TIP | 8.2,75.69 8.2,83.58 8.24,83.58 8.89,84.24 v8.89,89.15
  Bottom 0.22: 19.71,91.69 CON3-PCB1.5
  Bottom 0.254: v8.89,89.15 8.89,89.66 12.7,93.47 17.02,93.47 18.8,91.69
  Bottom 0.305: 18.8,91.69 19.71,91.69
CV-STRAIGHT-IN-2  (via drill 0.3)
  Top 0.22: CON4-PCB2.8 86.06,40.4 84.69,40.4 82.66,42.43 v82.66,47 | v59.8,46.75 v59.8,76.21 | v67.16,76.47 66.4,77.23 66.4,88.91 68.47,90.98 CON3-PCB2.5
  Bottom 0.22: v82.66,47 82.15,46.49 69.26,46.49 68.62,47.13 65.32,47.13 65.13,47.32 64.62,47.32 64.05,46.75 v59.8,46.75 | v59.8,76.21 66.91,76.21 v67.16,76.47
CV-STRAIGHT-IN-3
  Bottom 0.22: CON4-PCB3.8 135.49,39.75 135.49,37.6 132.5,34.62 110.15,34.62 109.07,33.54 105.26,33.54 101.39,37.41 101.39,49.99 R9.2
DFGT43
  Bottom 0.22: D6.CATHODE 21.09,68.44 23.53,66 SW4.P$3 27.81,66.05 31.86,66.05 32.25,66.17 SW4.P$4 34.09,66 37.95,69.86 37.95,73.13 C8.1
DVW4D  (via drill 0.3)
  Top 0.22: IC3.6 v71.23,68.91
  Bottom 0.22: v71.23,68.91 78.02,68.91 D9.ANODE
F-L  (via drill 0.3)
  Top 0.22: v34.65,56.65 34.65,57.67 33.38,58.94 33.38,63 34.4,64.02 34.4,66.81 33.64,67.58 33.64,68.34 34.65,69.35 34.65,71.64 32.98,73.31 L2.A
  Bottom 0.22: IC1.10 26.93,60.06 30.33,56.65 v34.65,56.65 36.94,54.37 36.94,53.49 IC1.1
FGDFS33
  Top 0.22: IC5.5 66.15,62.5 64.88,63.77 62.85,63.77 62.34,64.27 62.34,71.13 61.07,72.4 IC3.2
FSS44F
  Top 0.22: IC3.8 73.77,64.53 72.5,63.26 72.5,55.89 73.77,54.62 IC5.9
FWD-1  (via drill 0.3)
  Top 0.22: CON1-PCB1.1 28.67,37.24 29.34,37.91 29.34,41.27 30.61,42.55 30.61,45.09 29.53,46.16 29.53,50.29 28.2,51.63 v28.2,57.15 | R16.2 20.07,73.66 20.07,72.9 19.82,72.64 19.82,70.36 20.07,70.1 20.07,66.55 21.09,65.53 D6.ANODE | v16.3,58.3 14.99,59.74 IC2.13
  Bottom 0.22: v28.2,57.15 27.25,58.1 16.51,58.1 16.38,58.24 v16.3,58.3 | IC2.13 14.99,62.23 17.34,64.58 17.34,65.15 18.04,65.85 20.13,65.85 20.83,65.15 D6.ANODE
FWD-2  (via drill 0.3)
  Top 0.22: IC3.3 v63.61,69.61 | v58.02,69.61 57.51,69.1 57.51,67.32 54.72,64.53 54.72,47.26 57.51,44.46 67.16,44.46 v67.93,45.22 | v77.58,44.97 77.58,41.16 78.34,40.4 78.34,36.64 CON1-PCB2.1
  Bottom 0.22: v63.61,69.61 v58.02,69.61 | v67.93,45.22 68.18,45.48 77.07,45.48 v77.58,44.97
FWD-LED  (via drill 0.3)
  Top 0.22: IC2.12 12.81,60.6 12.81,55.64 13.7,54.75 13.7,52.02 14.4,51.32 15.6,51.32 16.24,51.95 16.24,54.75 18.9,57.42 v18.9,58.69
  Bottom 0.22: v18.9,58.69 23.22,58.69 24.49,59.96 24.49,60.86 IC1.9
HLD-1  (via drill 0.3)
  Top 0.22: CON1-PCB1.4 21.78,38.01 21.78,47.43 19.94,49.28 19.94,56.77 v20.32,57.15 | v9.91,57.15 IC2.11 9.91,61.98 9.28,62.61 9.28,72.2 7.5,73.98 7.5,74.04 v7.43,74.11 | R15.2 20.2,76.83 20.2,80.07 16.96,83.31 v16.51,83.31
  Bottom 0.22: v20.32,57.15 v9.91,57.15 | v16.51,83.31 13.97,83.31 12.7,84.58 6.1,84.58 5.34,83.82 1.34,83.82 D5.ANODE | v7.43,74.11 7.5,74.17 10.67,74.17 11.18,73.66 17.02,73.66 R15.2
HLD-2  (via drill 0.3)
  Top 0.22: v54.97,45.99 54.21,46.75 54.21,64.78 57,67.58 57,72.15 58.27,73.42 IC3.1
  Bottom 0.22: CON1-PCB2.4 70.72,36.64 70.72,37.6 69.96,38.37 69.96,43.7 69.45,44.21 67.93,44.21 66.15,45.99 v54.97,45.99
IO1-1  (via drill 0.6)
  Top 0.305: CON2-PCB1.8 10.86,14.67 11.94,15.75 11.94,16.51 v16.77,21.34 | v26.93,21.84 31.18,26.1 v31.18,46.99
  Bottom 0.305: v16.77,21.34 17.28,21.84 v26.93,21.84 | v31.18,46.99 27.18,46.99 24.64,44.45 I/O1.TIP
IO1-2  (via drill 0.6)
  Top 0.305: v51.16,9.66 51.16,16.78 R33.2
  Bottom 0.305: CON2-PCB2.8 60.71,10.07 60.31,9.66 v51.16,9.66
IO2-1
  Top 0.305: CON2-PCB1.6 15.94,11.62 21.59,17.27 21.59,21.34 23.37,23.11 23.37,29.47 I/O2.TIP
IO2-2  (via drill 0.6)
  Top 0.305: v53.96,8.39 50.91,8.39 50.4,8.9 50.4,18.56 R34.2
  Bottom 0.305: CON2-PCB2.6 65.79,9.81 64.37,8.39 v53.96,8.39
IO3-1
  Top 0.305: CON2-PCB1.4 21.02,14.12 I/O3.TIP
IO3-2
  Bottom 0.305: CON2-PCB2.4 70.87,11.08 72.5,12.71 82.66,12.71 86.47,16.52 R35.2
IO4-1
  Top 0.305: I/O4.TIP 26.1,6.2 CON2-PCB1.2
IO4-2  (via drill 0.6)
  Top 0.305: CON2-PCB2.2 75.95,14.13 v77.58,15.76
  Bottom 0.305: v77.58,15.76 83.42,15.76 83.93,16.27 R36.2
L1-1  (via drill 0.3)
  Top 0.22: v15.24,46.74 15.24,45.72 10.86,41.34 CON1-PCB1.8
  Bottom 0.22: L5.A 35.37,50.86 29.79,50.86 25.66,46.74 v15.24,46.74
L1-2
  Bottom 0.22: CON1-PCB2.8 60.71,37.5 62.85,39.64 64.62,39.64 66.15,41.16 IC9.12
L2-1  (via drill 0.3)
  Top 0.22: v28.96,48.26 25.24,48.26 v24.49,47.51
  Bottom 0.22: L6.A 35.98,39.37 | 35.98,39.37 35.98,45.81 33.53,48.26 v28.96,48.26 | 35.98,39.37 14.48,39.37 13.4,38.29 CON1-PCB1.7 13.32,37.16 13.32,36.08 15.09,34.3 15.86,34.3 17.89,32.27 17.89,28.21 16.62,26.94 16.62,25.16 17.38,24.4 R58.1 | v24.49,47.51 24.24,47.76 24.24,52.59 24.39,52.74 IC1.6
L2-2
  Top 0.22: CON1-PCB2.7 63.25,38.22 61.07,40.4 IC9.14
L3-1  (via drill 0.3)
  Top 0.22: L7.A 34.36,25.87 v34.36,33.53 | CON1-PCB1.6 15.94,38.54 17.78,40.39 17.78,47.5 19.56,49.28 19.56,69.85 19.31,70.1 19.31,72.9 19.56,73.15 19.56,73.82 20.62,74.88 20.62,81.74 v20.58,81.79 | v25.4,82.61 25,83.02 25,92.21 27.18,94.4 27.18,103.12 26.15,104.15 22.46,104.15 22.24,104.37 R54.2
  Bottom 0.22: v34.36,33.53 18.29,33.53 16.01,35.81 16.01,37.17 CON1-PCB1.6 | v20.58,81.79 21.09,82.3 25,82.31 25.1,82.31 v25.4,82.61 | R56.1 35.83,24.4 L7.A
L3-2
  Top 0.22: CON1-PCB2.6 65.79,35.72 64.37,34.3 59.54,34.3 58.53,35.32 IC9.15
L4-1  (via drill 0.3)
  Top 0.22: v8.64,8.38 8.64,20.57 11.94,23.88 11.94,29.97 12.96,30.99 13.72,30.99 18.48,35.75 CON1-PCB1.5 | v32.77,34.8 32.77,40.64 34.8,42.67 34.8,52.58 IC1.2
  Bottom 0.22: L8.A 33.11,8.38 16.51,8.38 14.23,6.1 14.23,5.33 13.72,4.83 12.45,4.83 11.69,4.06 11.69,3.3 11.43,3.05 8.89,3.05 8.7,3.24 8.7,8.32 v8.64,8.38 6.97,10.06 R57.1 | CON1-PCB1.5 18.55,37.17 18.55,35.81 19.82,34.54 32.52,34.54 v32.77,34.8
L4-2
  Top 0.22: CON1-PCB2.5 68.69,36.85 IC9.11
N$1  (via drill 0.3)
  Top 0.22: IC7.16 73.26,32.52 74.66,33.92 74.66,39 74.28,39.38 74.28,41.41 IC9.9 73.77,42.94 75.29,44.46 v75.29,57.42 | IC5.11 v68.69,57.42
  Bottom 0.22: IC6.16 59.8,33.79 71.74,33.79 IC7.16 | v68.69,57.42 v75.29,57.42
N$2  (via drill 0.3)
  Top 0.22: IC6.1 67.93,34.3 68.94,34.3 69.58,34.94 69.58,38.11 71.23,39.76 IC9.10 71.23,43.45 67.42,47.26 67.42,58.94 68.69,60.21 IC5.6 | IC7.1 v80.88,39.64
  Bottom 0.22: v80.88,39.64 72.24,39.64 71.23,40.65 IC9.10
N$3
  Top 0.22: R12.2 12.45,51.56 IC2.3
N$4
  Top 0.22: R22.1 77.58,54.88 C11.1
  Bottom 0.22: IC5.15 58.53,56.15 59.04,56.65 74.53,56.65 77.58,53.61 C11.1
N$5
  Bottom 0.305: IC6.9 57.77,13.98 53.96,13.98 52.69,12.71 R34.1
N$6  (via drill 0.6)
  Top 0.305: v77.58,13.98 77.83,13.98 80.13,11.69 R36.1
  Bottom 0.305: IC7.9 73.77,13.98 v77.58,13.98
N$7
  Top 0.22: L2.K 35.52,77.26 R4.1
N$8
  Bottom 0.22: R7.1 1.85,42.35 HLD.TIP 1.85,46.04 4.32,48.51 20.58,48.51 R11.1
N$9
  Top 0.305: IC7.8 83.67,14.49 R35.1
N$10  (via drill 0.3)
  Top 0.22: v16.07,56.07 13.72,58.42 13.72,62.48 10.78,65.43 10.78,66.81 11.79,67.83 11.79,68.85 10.78,69.86 10.78,73.67 11.53,74.42 v11.69,74.42
  Bottom 0.22: R16.1 15.75,74.42 v11.69,74.42 | v16.07,56.07 15.88,55.88 10.42,55.88 9.91,55.37 IC2.4
N$11  (via drill 0.3)
  Top 0.22: IC2.6 6.1,54.61 v6.1,64.01 | R17.1 16.64,77.85 16.64,75.56 14.61,73.53 14.61,65.6 14.29,65.28 v14.23,65.28
  Bottom 0.22: v6.1,64.01 12.96,64.01 v14.23,65.28
N$12
  Bottom 0.22: RES.TIP 1.85,29.07 R10.1 R14.1
N$13
  Bottom 0.305: R33.1 56.5,12.97 63.61,12.97 65.13,14.49 IC6.8
N$14
  Bottom 0.22: L1.K 14.23,97.79 11.69,97.79 R3.1
N$15
  Top 0.22: L3.K 30.93,101.09 R5.1
N$16  (via drill 0.3)
  Top 0.22: IC2.8 2.29,61.66 4.7,64.07 v4.7,72.9 | v12.7,72.9 14.23,74.42 v14.23,79.25
  Bottom 0.22: v4.7,72.9 v12.7,72.9 | v14.23,79.25 15.75,79.25 R18.1
N$17  (via drill 0.3)
  Top 0.22: v1.02,75.44 1.78,74.68 1.78,72.33 D8.CATHODE
  Bottom 0.22: C10.1 9.4,75.18 1.27,75.18 v1.02,75.44 | D8.CATHODE 1.21,68.29 3.5,66 SW6.P$3 7.56,66.31 11.79,66.31 12.1,66 SW6.P$4
N$18  (via drill 0.3)
  Top 0.22: v6.1,83.57 4.89,83.57 3.88,82.55 2.54,82.55 0.77,80.77 0.77,76.52 2.61,74.68 4.38,74.68 5.78,73.28 5.78,65.46 6.97,64.27 6.97,61.36 IC2.10 | v12.7,83.57 13.63,84.5 13.63,95.83 12.98,96.49 L1.A
  Bottom 0.22: v12.7,83.57 12.07,84.2 6.29,84.2 6.1,84.01 v6.1,83.57
N$19  (via drill 0.3)
  Top 0.22: v30.99,63.75 v30.99,68.58 | v32.01,57.91 IC1.3 | v35.31,81.28 34.55,82.04 34.55,92.71 37.34,95.5 37.34,97.28 35.06,99.57 v35.06,101.6
  Bottom 0.22: v32.01,57.91 30.74,59.18 30.74,63.25 30.99,63.5 v30.99,63.75 | v35.31,81.28 35.31,79.5 34.04,78.23 34.04,69.76 32.87,68.59 31,68.59 v30.99,68.58 | v35.06,101.6 36.96,101.6 D3.ANODE
N$20
  Top 0.22: R6.1 14.99,77.03 L4.K
N$21
  Top 0.22: R13.2 7.37,50.55 IC2.5
N$22
  Top 0.254: POWER.2 87.23,85.86 R2.1
  Bottom 0.254: POWER.1 POWER.2
N$23
  Bottom 0.254: R1.1 80.89,97.55 POWER.9 POWER.10
N$24
  Bottom 0.254: D1.A 66.78,102.37 74.03,102.37 R1.2
N$25
  Bottom 0.254: R2.2 87.09,68.97 D2.C
N$26  (via drill 0.3)
  Top 0.22: v4.07,46.23 3.56,46.74 3.56,58.42 4.83,59.69 IC2.9
  Bottom 0.22: v4.07,46.23 4.07,42.48 8.6,37.95 8.6,28.5 12.97,24.13 R14.2
N$27  (via drill 0.3)
  Top 0.22: IC2.2 14.99,54.1 17.02,56.13 17.02,58.42 16.26,59.18 16.26,68.07 v16.01,68.33
  Bottom 0.22: v16.01,68.33 17.02,68.33 18.8,70.1 18.8,72.01 19.88,73.09 21.53,73.09 R15.1
N$28
  Top 0.22: C7.1 0.51,94.23 0.51,90.93 1.21,90.23 D5.CATHODE
  Bottom 0.254: D5.CATHODE 5.25,86 SW3.P$3 7.62,86.37 11.79,86.37 12.16,86 SW3.P$4
N$29
  Top 0.22: R8.1 R9.1
  Bottom 0.22: R20.1 121.01,48.53 119.74,49.8 IC4.2 113.9,49.8 112.63,48.53 R8.1
N$30  (via drill 0.3)
  Top 0.22: v32.26,93.22 30.33,91.29 30.33,86.06 31.79,84.59 31.79,75.26 29.83,73.29 29.83,63.26 30.74,62.35 30.74,55.63 29.47,54.36 IC1.4
  Bottom 0.22: D4.ANODE 32.64,93.6 v32.26,93.22
N$31  (via drill 3.2 pad 6)
  other vias: 104.6,77.75
N$32  (via drill 0.3)
  Top 0.22: R38.1 125.33,61.73 v125.33,63.51
  Bottom 0.22: IC8.4 R37.2 123.04,64.02 124.82,64.02 v125.33,63.51
N$33
  Bottom 0.22: R38.2 IC8.6 117.71,59.7 113.65,55.64 103.99,55.64 R39.1
N$34
  Top 0.22: R39.2 104.5,60.21 104.5,62.75 R40.1
  Bottom 0.22: R39.2 IC8.8
  Bottom 0.254: IC8.11 109.84,66.05 103.74,66.05 R40.1
N$35
  Top 0.22: IC4.6 116.69,39.64 115.93,38.87 115.93,35.06 R27.1
  Bottom 0.22: D11.ANODE 126.09,37.86 124.82,39.13 119.23,39.13 IC4.6
N$36
  Top 0.22: R31.2 107.55,61.48 104.76,64.27 104.76,67.58 R43.1
  Bottom 0.22: R31.2 IC8.9
N$37  (via drill 0.3)
  Top 0.22: v134.47,61.73 v134.47,71.64
  Bottom 0.22: IC8.7 R30.2 122.28,56.15 122.79,55.64 128.38,55.64 v134.47,61.73 | v134.47,71.64 128.12,71.64 R42.1
N$38  (via drill 0.3)
  Top 0.22: v129.39,62.5 128.63,63.26 128.63,68.59 R41.1
  Bottom 0.22: IC8.5 R29.2 125.58,62.24 126.66,63.32 128.06,63.32 128.89,62.5 v129.39,62.5
N$39
  Top 0.254: R21.2 D9.CATHODE
  Bottom 0.254: D10.CATHODE D9.CATHODE | R22.2 R21.2
N$40  (via drill 0.3)
  Top 0.22: L5.K 38.61,50.16 v38.61,47.5 38.93,47.18 38.93,37.66 L6.K 38.93,36.84 38.93,24.66 L7.K 38.93,23.84 38.93,11.66 L8.K
  Bottom 0.22: R32.2 32.13,49.15 36.71,49.15 38.36,47.5 v38.61,47.5
N$41
  Top 0.22: IC8.13 IC8.14 | D14.ANODE 107.68,69.99 R43.2 R46.1
  Bottom 0.22: IC8.14 D14.ANODE
N$42
  Top 0.305: IC7.10 73.51,17.03 | 73.51,17.03 75.29,15.25 75.29,12.78 74.72,12.2 74.72,5.16 75.8,4.08 R50.2 | 73.51,17.03 74.28,17.03 75.55,18.3 75.55,20.59 79.61,24.65 IC7.4
  Bottom 0.305: R25.2 R50.2 | IC6.12 62.34,22.11 64.88,19.57 IC6.6 66.91,19.57 69.45,17.03 IC7.10
N$43
  Top 0.22: D13.ANODE 117.07,77.36 R44.1 120.76,73.67 120.76,70.88 119.74,69.86 IC8.2
  Bottom 0.22: IC8.2 R41.2
N$44  (via drill 3.2 pad 6)
  other vias: 27.75,78.5
N$45
  Top 0.22: IC4.12 113.14,47.26 113.9,46.49 113.9,42.43 114.66,41.67 117.71,41.67 118.22,42.18 IC4.5
  Bottom 0.22: R19.2 121.52,42.18 IC4.5
N$46
  Bottom 0.22: D11.CATHODE 121.39,37.1 IC4.7
N$47
  Top 0.22: D4.CATHODE 39.12,101.22 39.12,107.7 37.85,108.97 D3.CATHODE
  Bottom 0.22: D3.CATHODE 37.81,108.84 37.7,108.72 27.52,108.72 SW2.3 | R55.1 29.51,97.8 31.86,97.8 34.01,99.95 D4.CATHODE
N$48
  Top 0.305: R51.2 79.87,6.88 81.9,8.9 86.47,8.9 87.99,10.43 87.99,21.6 87.23,22.36 81.13,22.36 IC7.5 | IC7.13 72.5,24.65 69.7,21.86 69.7,18.55 68.18,17.03 IC6.7
  Bottom 0.305: R26.2 R51.2 | IC6.11 61.32,19.57 63.86,17.03 IC6.7 | IC7.13 76.05,24.65 78.59,22.11 IC7.5
N$49  (via drill 3.2 pad 6)
  other vias: 54.6,77.75
N$50  (via drill 3.2 pad 6)
  other vias: 77.6,77.75
N$51
  Top 0.22: R11.2 17.53,50.55 IC2.1
N$52
  Bottom 0.22: D12.CATHODE 121.01,51.07 119.74,52.34 IC4.1
N$53
  Top 0.22: IC4.9 112.12,39.64 113.39,38.37 113.39,34.56 R27.2
  Bottom 0.22: IC4.9 109.07,39.64 R28.1 R52.2
N$54
  Top 0.22: R31.1 100.95,58.18 100.95,42.68 R28.2 | R30.1 129.14,58.94 129.14,60.46 R29.1
  Bottom 0.22: R28.2 109.07,37.1 IC4.8 | R31.1 103.74,60.97 126.09,60.97 R29.1
N$55  (via drill 3.2 pad 6)
  other vias: 127.6,77.75
N$56
  Top 0.305: IC6.5 65.13,22.11 62.85,19.82 62.85,14.3 64.5,12.65 64.5,8.01 R24.2
  Bottom 0.305: R49.2 R24.2 | IC6.13 62.59,24.65 65.13,22.11 IC6.5 66.4,22.11 68.94,19.57 IC7.11 75.8,19.57 78.34,17.03 IC7.7
N$57  (via drill 0.6)
  Top 0.305: v55.23,5.35 56.75,6.87 56.75,12.2 55.99,12.97 55.99,15.76 57.26,17.03 IC6.10 59.29,17.03 60.81,18.55 60.81,22.87 61.58,23.63 62.85,23.63 63.86,24.65 IC6.4 | IC7.12 73.01,21.86 71.99,21.86 70.72,20.59 v70.72,15.76
  Bottom 0.305: R23.2 R48.2 56.5,4.08 v55.23,5.35 | v70.72,15.76 60.56,15.76 59.29,17.03 IC6.10 | IC7.12 75.8,22.11 78.34,19.57 IC7.6
N$58
  Top 0.22: IC4.14 IC4.13
  Bottom 0.22: R8.2 106.79,52.84 110.34,52.84 110.85,52.34 IC4.14
N$59  (via drill 0.3)
  Top 0.22: D12.ANODE 128.12,50.69 128.12,48.78 R20.2 127.87,43.95 132.19,39.64 v132.19,36.59
  Bottom 0.22: R52.1 105.26,34.56 105.9,33.92 108.88,33.92 109.96,35 130.6,35 v132.19,36.59
N$60
  Top 0.22: R54.1 19.7,107.33 Q3.2
  Bottom 0.22: SW2.1 31.72,103.52 18.43,103.52 R54.1
N$400  (via drill 3.2 pad 6)
  other vias: 4.75,78.5
OI1-1  (via drill 0.6)
  Top 0.305: CON2-PCB1.7 13.4,11.87 18.04,16.51 v18.04,26.16 | v36.33,33.53 34.29,35.56 34.29,40.39 O/I1.TIP
  Bottom 0.305: v18.04,26.16 28.45,26.16 29.72,27.43 32.52,27.43 35.56,30.48 35.56,32.77 v36.33,33.53
OI1-2
  Top 0.305: CON2-PCB2.7 63.25,9.31 61.83,7.89 59.54,7.89 55.73,4.08 R48.1
OI2-1  (via drill 0.6)
  Top 0.305: CON2-PCB1.5 18.55,11.31 18.55,12.95 22.86,17.27 v22.86,20.57
  Bottom 0.305: v22.86,20.57 28.04,20.57 29.57,22.11 29.57,23.38 32.11,25.92 32.87,25.92 37.7,30.75 O/I2.TIP
OI2-2
  Bottom 0.305: R49.1 57,6.62 58.27,5.35 63.86,5.35 68.43,9.92 68.43,10.39 CON2-PCB2.5
OI3-1
  Bottom 0.305: CON2-PCB1.3 23.63,11.31 23.63,12.19 25.15,13.72 33.53,13.72 37.57,17.75 O/I3.TIP
OI3-2
  Top 0.305: R50.1 73.41,6.77 CON2-PCB2.3
OI4-1
  Top 0.305: O/I4.TIP 31.16,11.24 CON2-PCB1.1
OI4-2
  Bottom 0.305: R51.1 76.05,6.62 78.34,8.9 78.34,10.34 CON2-PCB2.1
P0-2  (via drill 0.3)
  Top 0.22: IC5.4 64.88,60.21 v64.88,46.75
  Bottom 0.22: v64.88,46.75 68.43,46.75 69.2,45.99 85.55,45.99 CON4-PCB2.6
P0-3  (via drill 0.3)
  Top 0.22: v115.17,42.94 115.17,73.04 D13.CATHODE
  Bottom 0.22: CON4-PCB3.6 131.72,45.44 R47.1 128.63,45.48 125.58,42.43 122.54,42.43 121.71,43.26 115.49,43.26 v115.17,42.94 | D14.CATHODE 105.01,72.4 110.09,77.48 D13.CATHODE
P1-2
  Bottom 0.22: IC5.12 66.15,55.13 67.16,56.15 74.28,56.15 78.09,52.34 80.88,52.34 85.24,47.98 CON4-PCB2.5
P1-3  (via drill 0.3)
  Top 0.22: R45.1 121.52,73.16 R42.2 | v114.41,48.53 114.66,48.78 114.66,59.7 112.12,62.24 IC8.10
  Bottom 0.22: R42.2 IC8.1 117.71,72.4 116.19,70.88 116.19,62.75 115.68,62.24 IC8.10 | CON4-PCB3.5 135.2,47.98 133.97,46.75 122.03,46.75 120.25,48.53 v114.41,48.53
R-L
  Top 0.22: IC1.5 26.93,57.31 29.32,59.7 29.32,60.81 IC1.11 24.49,65.94 24.49,76.97 24.24,77.23 24.24,79.77 26.27,81.8 27.03,81.8 28.56,83.32 28.56,87.13 29.32,87.9 29.32,91.45 32.98,95.11 L3.A
RES-1  (via drill 0.3)
  Top 0.22: v1.02,57.66 0.32,58.36 0.32,64.52 D8.ANODE 1.27,65.47 1.27,66.8 v2.8,68.33 | v23.12,57.15 23.12,47.75 22.8,47.43 22.8,38 CON1-PCB1.3 | v26.67,83.06 25.53,84.2 25.53,92.01 29.6,96.08 29.6,98.11 v30.74,99.25
  Bottom 0.22: v1.02,57.66 1.08,57.72 22.55,57.72 v23.12,57.15 | v26.67,83.06 26.74,82.93 25.53,81.72 23.31,81.72 R18.2 21.47,79.88 16.96,79.88 14.23,77.15 14.23,75.18 13.97,74.93 12.2,74.93 11.94,75.18 11.43,75.18 10.93,74.68 0.77,74.68 0.32,74.23 0.32,73.47 0.64,73.15 2.04,73.15 2.8,72.39 v2.8,68.33 | v30.74,99.25 29.98,98.49 27.12,98.49 25.91,99.69 Q1.2
RES-2  (via drill 0.3)
  Top 0.22: CON1-PCB2.3 73.51,36.59 73.51,37.6 72.5,38.62 v72.5,44.72 | v76.05,44.72 v76.05,68.08
  Bottom 0.22: v72.5,44.72 v76.05,44.72 | v76.05,68.08 71.23,68.08 | 71.23,68.08 IC3.9 | IC3.13 61.07,66.81 62.34,68.08 71.23,68.08
RES-LED-1
  Top 0.22: L4.A 12.98,81.26 11.54,82.7 11.54,83.83 10.97,84.4 10.97,94.66 11.88,95.57 11.88,100.52 13.21,101.85 19.71,101.85 CON3-PCB1.1
RES-LED-2
  Top 0.22: CON3-PCB2.1 66.4,97.94 66.4,90.31 66.02,89.93 66.02,76.34 64.88,75.2 64.88,68.85 63.61,67.58 IC3.12
REV-1
  Top 0.22: CON1-PCB1.2 26.1,37.98 23.18,40.89 23.18,47.24 23.94,48.01 23.94,50.35 25.66,52.07 25.66,62.35 23.98,64.02 23.98,76.85 22.71,78.12 22.71,78.64 R17.2 22.67,78.68
  Bottom 0.22: D7.ANODE 26.61,82.17 25.79,81.34 25.21,81.34 R17.2
REV-2  (via drill 0.3)
  Top 0.22: IC3.5 68.69,71.39 66.15,68.85 IC3.11 66.15,64.53 67.42,63.26 67.42,59.96 v66.15,58.69 | v78.85,58.69 78.85,55.13 81.9,52.08 v81.9,38.87
  Bottom 0.22: v66.15,58.69 v78.85,58.69 | v81.9,38.87 77.07,38.87 75.95,37.75 CON1-PCB2.2
REV-LED-1  (via drill 0.3)
  Top 0.22: v19.6,77.61 19.6,79.07 18.78,79.89 17,79.89 16.11,80.78 16.11,81.8 14.08,83.83 14.08,98.31 14.59,98.82 19.22,98.82 CON3-PCB1.2 | v34.4,67.83 35.16,67.07 35.16,61.73 34.55,61.12 IC1.13
  Bottom 0.22: v34.4,67.83 27.03,67.83 25.25,69.61 25.25,73.42 23.35,75.32 22.27,75.32 19.98,77.61 v19.6,77.61
REV-LED-2
  Top 0.22: CON3-PCB2.2 73.26,94.94 73.26,79.26 69.96,75.96 69.96,70.88 68.69,69.61 IC3.10
STEP-LIMIT
  Top 0.22: SW2.2 28.81,105.31 28.81,101.36 28.45,101 Q1.1
XBGE4  (via drill 0.3)
  Top 0.22: IC5.10 71.23,54.88 69.96,56.15 v69.96,69.61
  Bottom 0.22: D10.ANODE 76.18,69.61 v69.96,69.61 69.2,69.61 66.15,72.66 IC3.4

### Text on the board
tPlace: on-on | on-off-on | PCB2 | PCB1 | PCB3 : ADC
bPlace: -12V | Pb | Pb | Roll Your Own | Roll Your Own | ljunggrenaudio.com 2015 | PATHS 1.0 | PATHS 1.0 | PATHS 1.0 | Roll Your Own | ljunggrenaudio.com 2015 | Pb | ljunggrenaudio.com 2015